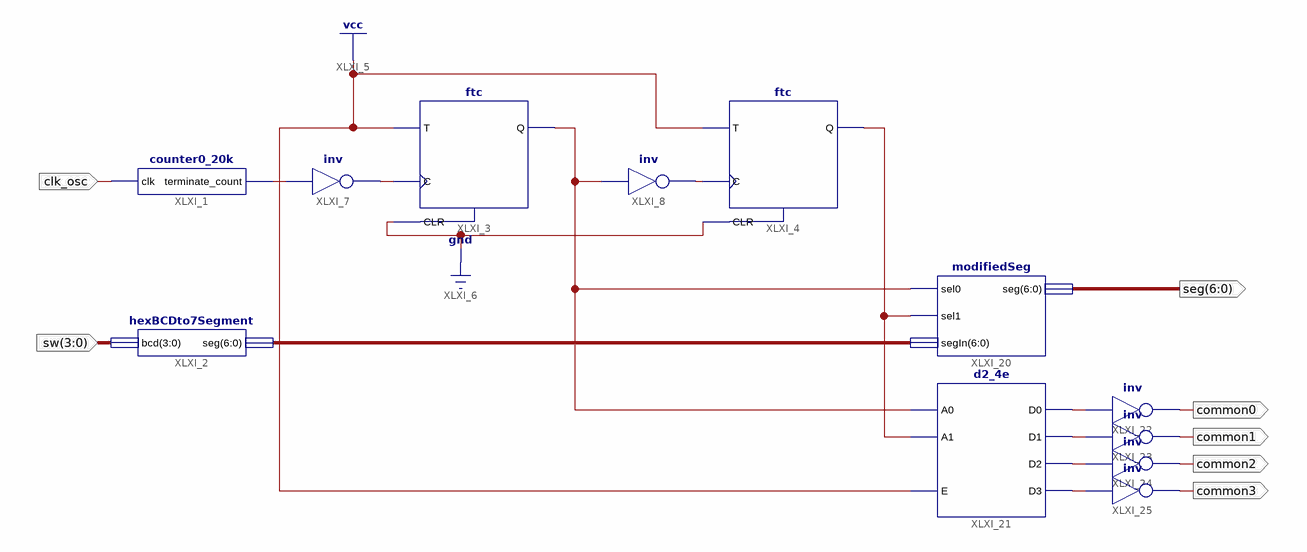
[diagram p0: schematic sheet 1]
// Xilinx ISE schematic top.sch (spartan6) as structural Verilog: 12 symbols, 7 ports
module top (
  input  clk_osc,
  input  [3:0] sw,
  output common0,
  output common1,
  output common2,
  output common3,
  output [6:0] seg
);

  wire XLXN_5, XLXN_7, XLXN_8, XLXN_10, XLXN_26, XLXN_31, XLXN_32, XLXN_33, XLXN_34;
  wire [6:0] XLXN_27;

  ftc XLXI_3 (.C(XLXN_5), .CLR(1'b0), .T(1'b1), .Q(XLXN_7));
  not XLXI_7 (XLXN_5, XLXN_8);
  ftc XLXI_4 (.C(XLXN_10), .CLR(1'b0), .T(1'b1), .Q(XLXN_26));
  not XLXI_8 (XLXN_10, XLXN_7);
  counter0_20k XLXI_1 (.clk(clk_osc), .terminate_count(XLXN_8));
  hexBCDto7Segment XLXI_2 (.bcd(sw), .seg(XLXN_27));
  modifiedSeg XLXI_20 (.sel0(XLXN_7), .sel1(XLXN_26), .segIn(XLXN_27), .seg(seg));
  d2_4e XLXI_21 (.A0(XLXN_7), .A1(XLXN_26), .E(1'b1), .D0(XLXN_31), .D1(XLXN_32), .D2(XLXN_33), .D3(XLXN_34));
  not XLXI_22 (common0, XLXN_31);
  not XLXI_23 (common1, XLXN_32);
  not XLXI_24 (common2, XLXN_33);
  not XLXI_25 (common3, XLXN_34);
endmodule
